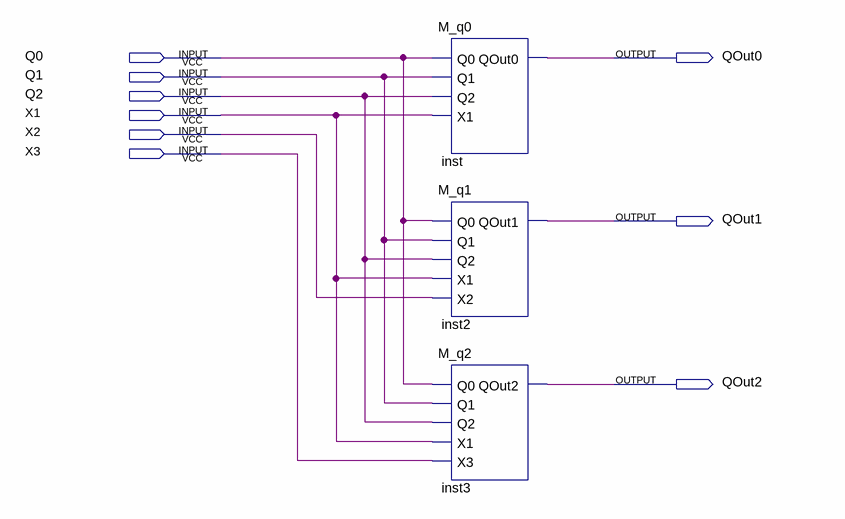
[diagram p0: schematic sheet]
// Quartus schematic M_QX_to_Q.bdf as structural Verilog: 3 symbols, 9 pins
module M_QX_to_Q (
  input  Q0,
  input  Q1,
  input  Q2,
  input  X1,
  input  X2,
  input  X3,
  output QOut0,
  output QOut1,
  output QOut2
);

  M_q0 inst (.Q0(Q0), .Q1(Q1), .Q2(Q2), .X1(X1), .QOut0(QOut0));
  M_q1 inst2 (.Q0(Q0), .Q1(Q1), .Q2(Q2), .X1(X1), .X2(X2), .QOut1(QOut1));
  M_q2 inst3 (.Q0(Q0), .Q1(Q1), .Q2(Q2), .X1(X1), .X3(X3), .QOut2(QOut2));
endmodule
